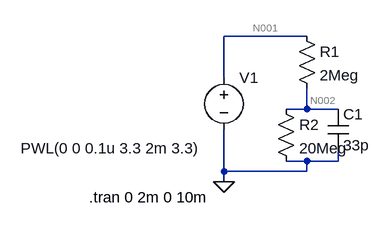
[diagram p0: schematic Draft5.asc]
Draft5.asc, the LTspice schematic file:
Version 4
SHEET 1 880 680
WIRE 432 32 304 32
WIRE 304 96 304 32
WIRE 432 144 432 112
WIRE 432 144 400 144
WIRE 480 144 432 144
WIRE 432 224 400 224
WIRE 480 224 480 208
WIRE 480 224 432 224
WIRE 304 240 304 176
WIRE 432 240 432 224
WIRE 432 240 304 240
WIRE 304 256 304 240
FLAG 304 256 0
SYMBOL res 416 16 R0
SYMATTR InstName R1
SYMATTR Value 2Meg
SYMBOL res 384 128 R0
SYMATTR InstName R2
SYMATTR Value 20Meg
SYMBOL cap 464 144 R0
SYMATTR InstName C1
SYMATTR Value 33p
SYMBOL voltage 304 80 R0
WINDOW 3 -313 124 Left 2
WINDOW 123 0 0 Left 0
WINDOW 39 0 0 Left 0
SYMATTR Value PWL(0 0 0.1u 3.3 2m 3.3)
SYMATTR InstName V1
TEXT 96 280 Left 2 !.tran 0 2m 0 10m

The netlist it stands for:
* Draft5.asc
R1 N001 N002 2Meg
R2 N002 0 20Meg
C1 N002 0 33p
V1 N001 0 PWL(0 0 0.1u 3.3 2m 3.3)
.tran 0 2m 0 10m
.backanno
.end

* Results of the author's LTspice run, read from the files saved beside the schematic
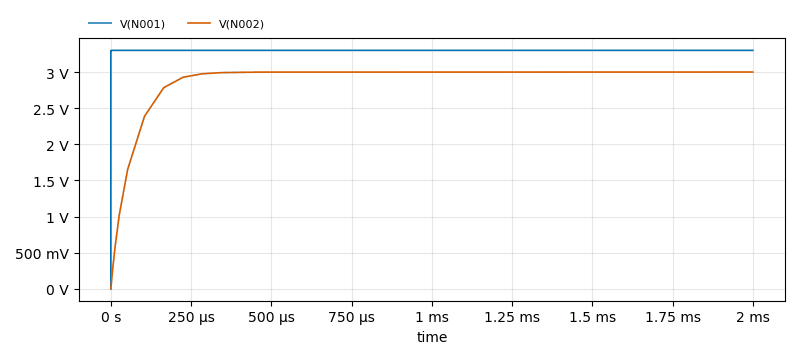
[diagram p1: Transient Analysis of Draft5.asc, plotted from the saved traces]
* Transient Analysis, 1 run:
*   V(N001): min 0 V, max 3.3 V, average 3.3 V, rms 3.3 V, last 3.3 V
*   V(N002): min 0 V, max 3 V, average 2.901 V, rms 2.926 V, last 3 V